# Altium schematic sheet CAN_Transceiver.SchDoc
size A; SheetNumber: 5; SheetTotal: 5; Parameter 1: 120
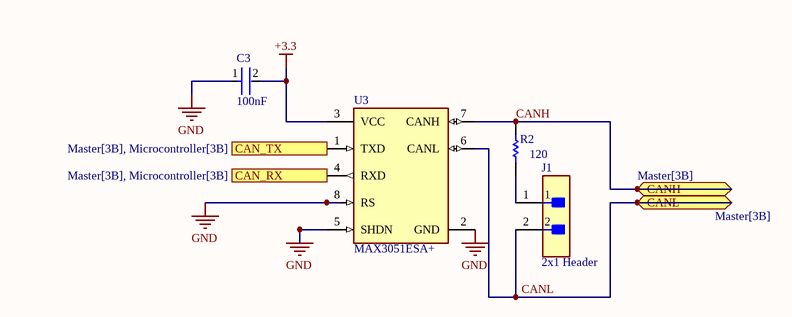
[diagram p0: CAN_Transceiver.SchDoc]

## Parts
C3  100nF  [CAPC0603(1608)100_L]
J1  2x1 Header  [0.1" Header 2x1-Footprint]
R2  120  [RESC2013X50X30ML20T20]
U3  MAX3051ESA+  [FP-S8-4-IPC_B]

## Ports
CAN_RX (see Master[3B], Microcontroller[3B]), CAN_TX (see Master[3B], Microcontroller[3B]), CANH (bidir, see Master[3B]), CANL (bidir, see Master[3B])

## Nets
+3.3: C3.2 U3.3(VCC)
GND: C3.1 U3.2(GND) U3.5(SHDN) U3.8(RS)
CAN_RX: U3.4(RXD) ; port CAN_RX
CAN_TX: U3.1(TXD) ; port CAN_TX
CANH: R2.2 U3.7(CANH) ; port CANH
CANL: J1.2 U3.6(CANL) ; port CANL
NetJ1_1: J1.1 R2.1

## Library data of the parts
C3 = CMP-001-00083-4: GENERIC CAPACITOR 0805 or 0603(1608)
J1 = CMP-002-00002-10: Board Connector, 2 Contact(s), 1 Row(s), Male, Straight, 0.1 inch and 0.079 inch Pitch, Solder Terminal, Locking, Black Insulator; RoHS Compliant: Yes; Connector Type: BOARD CONNECTOR; Mounting Technology: Board
R2 = CMP-009-00177-4: Surface Mount 0805 Resistor
U3 = CMP-015-00014-1: MAX3051 Series 3.3 V 1 Mbps Low-Supply-Current CAN Transceiver - SOIC-8